# EAGLE design Controller_V5 (EAGLE 5.00)
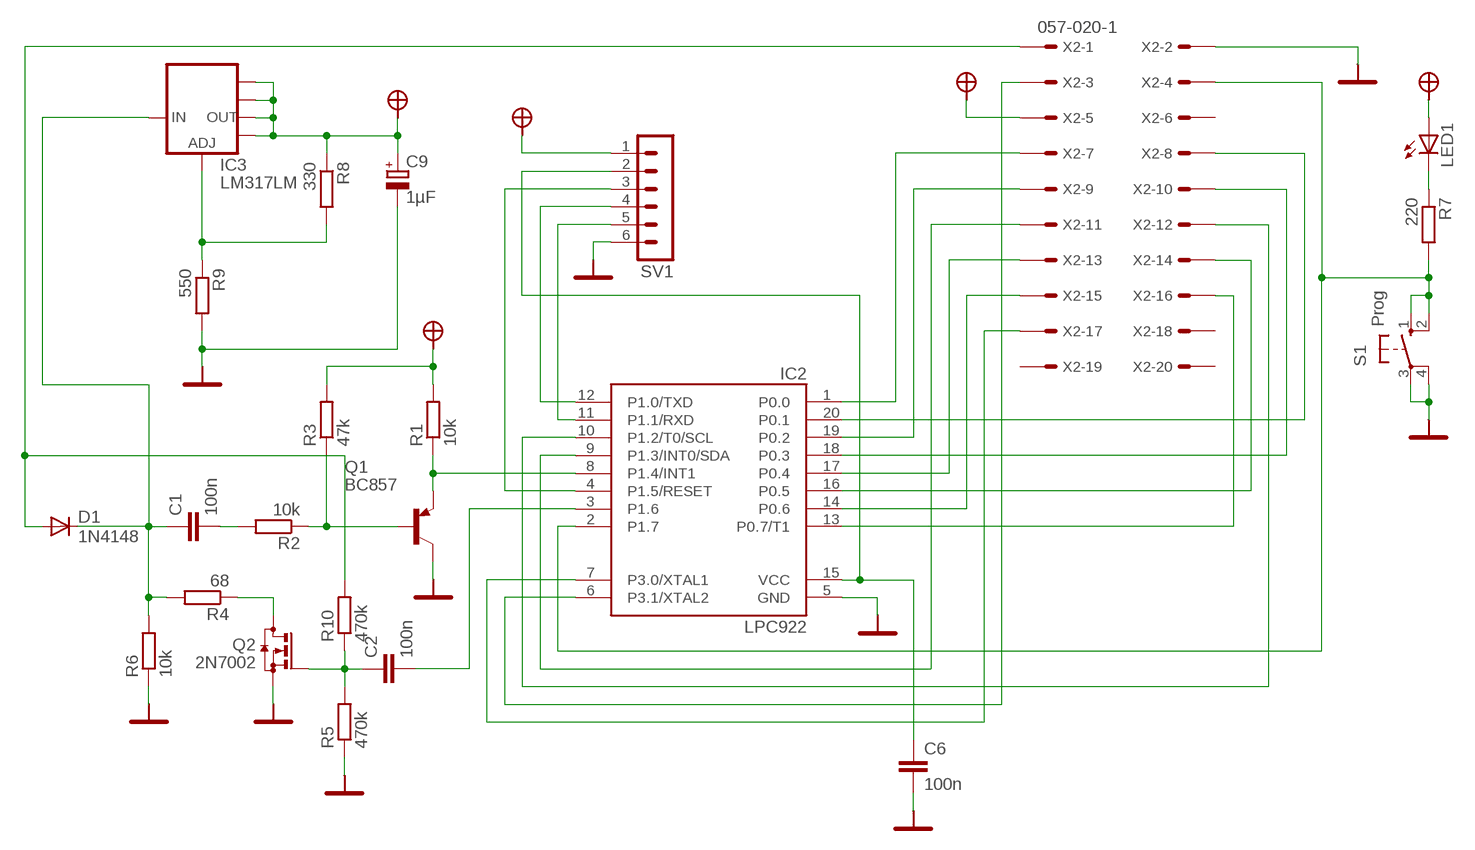
[diagram p0: schematic, sheet 1]

## Parts
C1  100n  C-EUC0805K  [C0805K]
C2  100n  C-EUC0805K  [C0805K]
C6  100n  C-EUC0805K  [C0805K]
C9  1µF  CPOL-EUCT3528  [CT3528]
D1  1N4148  DIODE-SOD106A-R  [SOD106A-R]
IC2  LPC922  [TSSOP20]
IC3  LM317LM  [SO8]
LED1  LEDCHIPLED_1206  [CHIPLED_1206]
Q1  BC857  BC857CSMD  [SOT23-BEC]
Q2  2N7002  BSS123  [SOT23]
R1  10k  R-EU_M0805  [M0805]
R2  10k  R-EU_M0805  [M0805]
R3  47k  R-EU_M0805  [M0805]
R4  68  R-EU_M0805  [M0805]
R5  470k  R-EU_M0805  [M0805]
R6  10k  R-EU_M0805  [M0805]
R7  220  R-EU_M0805  [M0805]
R8  330  R-EU_M0805  [M0805]
R9  550  R-EU_M0805  [M0805]
R10  470k  R-EU_M0805  [M0805]
S1  Prog  10-XX_SMD  [B3F-10XX_SMD]
SV1  MA06-1  [MA06-1]
X2  057-020-1  [057-020-1]

## Nets
5V: C1.1 D1.C IC3.1(IN) R4.2 R6.2
EIB+: D1.A R10.2 X2.1
GND: C6.2 C9.- IC2.5(GND) Q1.C Q2.2(S) R5.1 R6.1 R9.2 S1.3(P) S1.4(P1) SV1.6 X2.2
N$1: IC2.4(P1.5/RESET) SV1.3
N$2: IC2.1(P0.0) X2.7
N$3: C1.2 R2.2
N$4: Q1.B R2.1 R3.1
N$5: LED1.C R7.1
N$6: Q2.3(D) R4.1
N$7: C2.1 Q2.1(G) R5.2 R10.1
N$8: IC2.6(P3.1/XTAL2) X2.3
N$9: IC2.20(P0.1) X2.8
N$10: IC2.11(P1.1/RXD) SV1.5
N$11: IC2.12(P1.0/TXD) SV1.4
N$12: IC2.19(P0.2) X2.9
N$13: IC2.18(P0.3) X2.10
N$14: IC2.17(P0.4) X2.13
N$15: IC2.16(P0.5) X2.14
N$16: IC2.14(P0.6) X2.15
N$17: IC2.13(P0.7/T1) X2.16
N$19: C2.2 IC2.3(P1.6)
N$20: IC2.2(P1.7) R7.2 S1.1(S) S1.2(S1) X2.4
N$21: IC2.10(P1.2/T0/SCL) X2.12
N$22: IC2.9(P1.3/INT0/SDA) X2.11
N$23: IC2.8(P1.4/INT1) Q1.E R1.1
N$25: IC2.7(P3.0/XTAL1) X2.17
N$26: C6.1 IC2.15(VCC) SV1.2
N$27: IC3.4(ADJ) R8.2 R9.1
VCC: C9.+ IC3.2(OUT) IC3.3(OUT) IC3.6(OUT) IC3.7(OUT) LED1.A R1.2 R3.2 R8.1 SV1.1 X2.5
Unconnected: X2.6 X2.18 X2.19 X2.20

## Library data of the parts
C1 C2 C6 = rcl:C-EU: CAPACITOR, European symbol
C9 = rcl:CPOL-EU: POLARIZED CAPACITOR, European symbol
D1 = diode:DIODE-: DIODE
IC2 = Philips:LPC922
IC3 = Reichelt:LM317LM
LED1 = led:LED: LED OSRAM: - CHIPLED LG R971, LG N971, LY N971, LG Q971, LY Q971, LO R971, LY R971 LH N974, LH R974 LS Q976, LO Q976, LY Q976 LO Q996 - Hyper CHIPLED LW Q18S LB Q993, LB Q99A, LB R99A - SideLED LS A670, LO A670, LY A670, LG A670, LP A670 LB A673, LV A673, LT A673, LW A673 LH A674 LY A675 LS A676, LA A676, LO A676, LY A676, LW A676 LS A679, LY A679, LG A679 - Hyper Micro SIDELED® LS Y876, LA Y876, LO Y876, LY Y876 LT Y87S - SmartLED LW L88C, LW L88S LB L89C, LB L89S, LG L890 LS L89K, LO L89K, LY L89K LS L896, LA L896, LO L896, LY L896 - TOPLED LS T670, LO T670, LY T670, LG T670, LP T670 LSG T670, LSP T670, LSY T670, LOP T670, LYG T670 LG T671, LOG T671, LSG T671 LB T673, LV T673, LT T673, LW T673 LH T674 LS T676, LA T676, LO T676, LY T676, LB T676, LH T676, LSB T676, LW T676 LB T67C, LV T67C, LT T67C, LS T67K, LO T67K, LY T67K, LW E67C LS E67B, LA E67B, LO E67B, LY E67B, LB E67C, LV E67C, LT E67C LW T67C LS T679, LY T679, LG T679 LS T770, LO T770, LY T770, LG T770, LP T770 LB T773, LV T773, LT T773, LW T773 LH T774 LS E675, LA E675, LY E675, LS T675 LS T776, LA T776, LO T776, LY T776, LB T776 LHGB T686 LT T68C, LB T68C - Hyper Mini TOPLED® LB M676 - Mini TOPLED Santana® LG M470 LS M47K, LO M47K, LY M47K Source: http://www.osram.convergy.de/
Q1 = transistor-pnp:BC857*: PNP Transistror
Q2 = transistor-small-signal:BSS123: N-CHANNEL MOS FET
R1-R10 = rcl:R-EU_: RESISTOR, European symbol
S1 = switch-omron:10-XX_SMD
SV1 = con-lstb:MA06-1: PIN HEADER
X2 = con-panduit:057-020-: CONNECTOR 20-pin series 057 contact pc board low profile headers

## Board
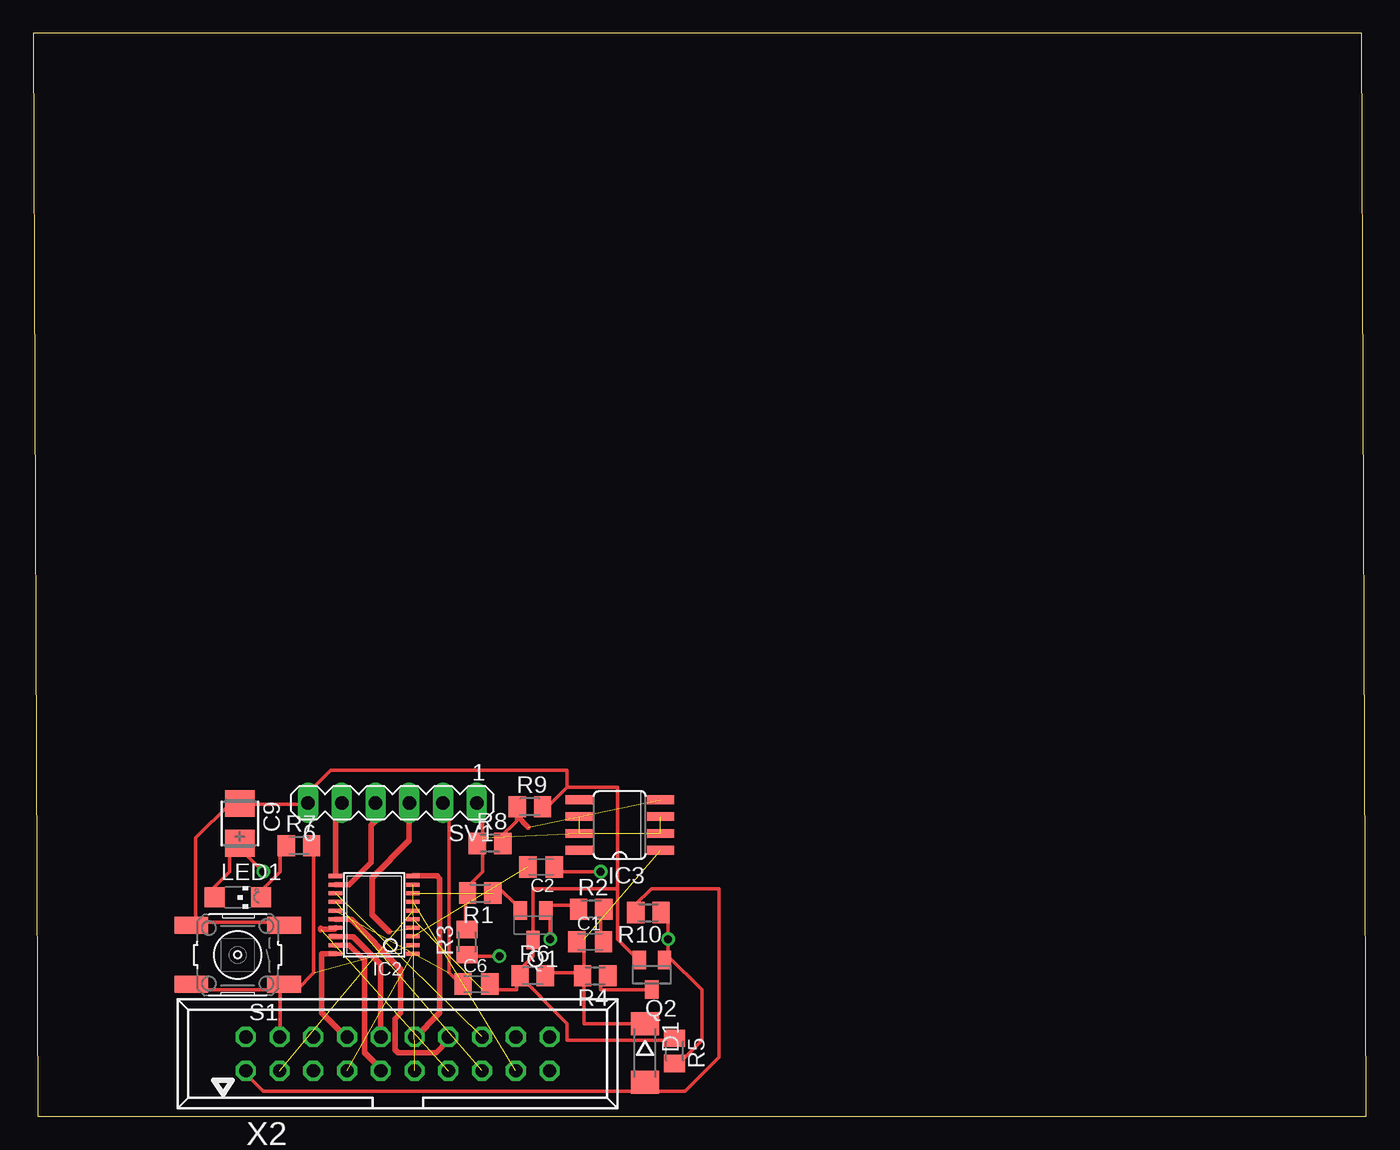
[diagram p1: board, top side]
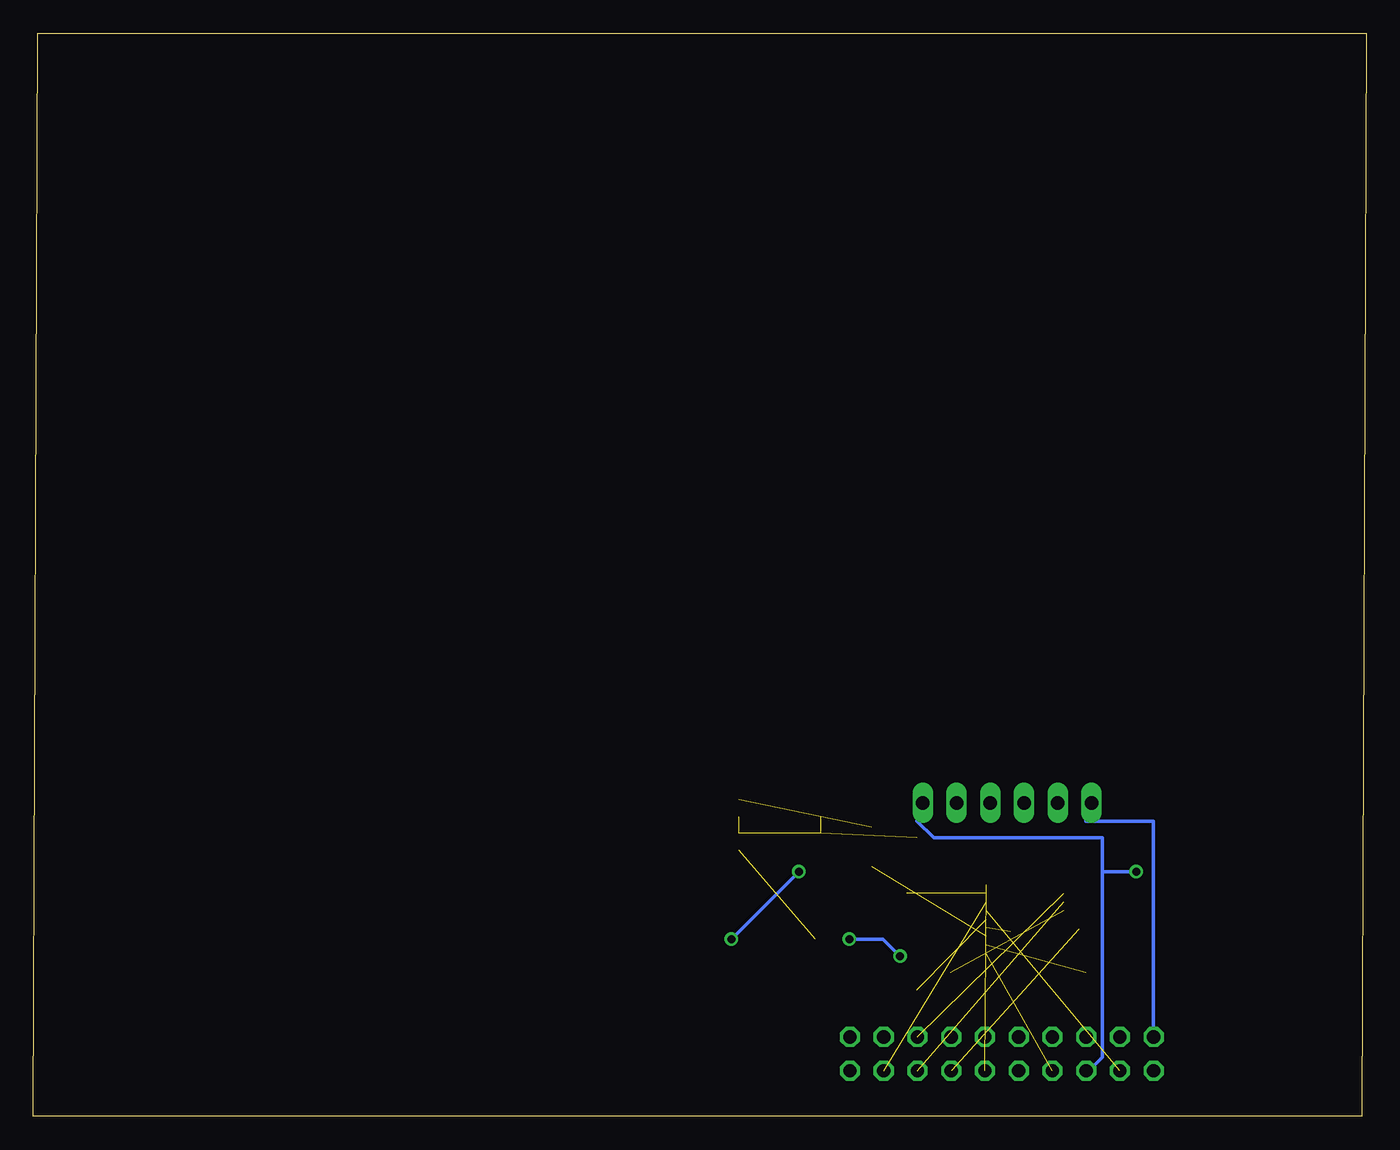
[diagram p2: board, bottom side, seen from below]

Size 100.33 x 81.49 mm. Coordinates in mm from the lower left corner, seen from the top.
Outline: 0.33,0 100.33,0 100,81.49 0,81.49 0.33,0
Copper layers (1*16): Top 0.035mm / dielectric 1.5mm / Bottom 0.035mm
Design rules "default": minimum track width 10mil, minimum drill 24mil, track to track 8mil, track to pad 8mil, pad to pad 8mil, via to via 8mil, smd to smd 8mil, copper to edge 40mil, drill to drill 8mil, minimum pad ring 10mil, minimum via ring 8mil, stop-mask expansion 4mil, vias tented up to drill 0mil, thermal gap 10mil

### Footprints (pad centres in the part's own frame; a part is rotated, then mirrored left to right if it is on the bottom)
C0805K = smd 1.3 x 1.6: 1 -1,0; 2 1,0
CT3528 = smd 2 x 2.2: + 1.5,0; - -1.5,0
SOD106A-R = smd 1.7 x 2.1: A 2.2,0; C -2.2,0
TSSOP20 = smd 0.305 x 0.991: 1 -2.925,-2.918; 2 -2.275,-2.918; 3 -1.625,-2.918; 4 -0.975,-2.918; 5 -0.325,-2.918; 6 0.325,-2.918; 7 0.975,-2.918; 8 1.625,-2.918; 9 2.275,-2.918; 10 2.925,-2.918; 11 2.925,2.918; 12 2.275,2.918; 13 1.625,2.918; 14 0.975,2.918; 15 0.325,2.918; 16 -0.325,2.918; 17 -0.975,2.918; 18 -1.625,2.918; 19 -2.275,2.918; 20 -2.925,2.918
SO8 = smd 0.66 x 2.032: 1 -1.905,-3.073; 2 -0.635,-3.073; 3 0.635,-3.073; 4 1.905,-3.073; 5 1.905,3.073; 6 0.635,3.073; 7 -0.635,3.073; 8 -1.905,3.073
CHIPLED_1206 = smd 1.5 x 1.5: A 0,-1.75; C 0,1.75
SOT23-BEC = smd 1 x 1.4: B -0.95,-1.1; C 0,1.1; E 0.95,-1.1
SOT23 = smd 1 x 1.4: 1 -0.95,-1.1; 2 0.95,-1.1; 3 0,1.1
M0805 = smd 1.3 x 1.6: 1 -0.95,0; 2 0.95,0
B3F-10XX_SMD = smd 2.54 x 1.27: 1 -3.493,2.223; 2 3.493,2.223; 3 -3.493,-2.223; 4 3.493,-2.223
MA06-1 = drill 1.016 long: 1 -6.35,0; 2 -3.81,0; 3 -1.27,0; 4 1.27,0; 5 3.81,0; 6 6.35,0
057-020-1 = drill 1 octagon: 1 -11.43,-1.27; 2 -11.43,1.27; 3 -8.89,-1.27; 4 -8.89,1.27; 5 -6.35,-1.27; 6 -6.35,1.27; 7 -3.81,-1.27; 8 -3.81,1.27; 9 -1.27,-1.27; 10 -1.27,1.27; 11 1.27,-1.27; 12 1.27,1.27; 13 3.81,-1.27; 14 3.81,1.27; 15 6.35,-1.27; 16 6.35,1.27; 17 8.89,-1.27; 18 8.89,1.27; 19 11.43,-1.27; 20 11.43,1.27

### Placement (x,y rotation side)
C1  41.92,13.13 0 top
C2  38.22,18.76 180 top
C6  33.36,9.96 0 top
C9  15.55,22.05 270 top
D1  46.04,4.77 270 top
IC2  25.66,15.16 90 top
IC3  44.14,21.93 90 top
LED1  15.4,16.48 270 top
Q1  37.62,14.38 180 top
Q2  46.56,10.66 180 top
R1  33.64,16.8 180 top
R2  42,15.59 0 top
R3  32.65,13.11 90 top
R4  42.29,10.58 180 top
R5  48.27,4.93 270 top
R6  37.59,10.58 0 top
R7  20.01,20.37 0 top
R8  34.38,20.54 0 top
R9  37.39,23.29 0 top
R10  46.3,15.33 180 top
S1  15.39,12.15 180 top
SV1  27.04,23.59 180 top
X2  27.43,4.71 0 top

### Tracks (layer width: path | path; a pad name or v marks a point on that pad's centre or on a via)
5V  (1 unrouted)
  Top 0.254: 41.44,10.79 38.9,10.79 R6.2 | 41.44,10.79 41.44,13.33 C1.1 | 41.44,10.79 41.44,6.98 45.25,6.98 D1.C | 41.44,10.79 R4.2
EIB+
  Top 0.254: R10.2 45.25,15.87 46.52,17.14 51.6,17.14 51.6,4.44 49.06,1.9 46.52,1.9 D1.A 45.25,1.9 17.31,1.9 16.04,3.17 X2.1
GND  (1 unrouted)
  Top 0.254: 12.23,14.6 18.58,14.6 S1.3 | 12.23,14.6 12.23,20.95 14.77,23.49 C9.- 16.04,23.49 21.12,23.49 SV1.6 21.12,24.76 22.39,26.03 40.17,26.03 40.17,24.76 | 12.23,14.6 S1.4 | 36.36,10.79 36.36,9.52 33.82,9.52 C6.2 | 36.36,10.79 40.17,6.98 40.17,5.71 47.79,5.71 R5.1 | 43.98,17.14 43.98,13.33 45.25,12.06 Q2.2 | 43.98,17.14 37.63,17.14 37.63,13.33 | 40.17,24.76 38.9,23.49 R9.2 | 40.17,24.76 43.98,24.76 43.98,17.14 | 36.36,10.79 37.63,12.06 37.63,13.33 | 36.36,10.79 R6.1 | 37.63,13.33 Q1.C
  Bottom 0.254: X2.2 16.04,5.71 16.04,22.22 21.12,22.22 SV1.6
N$1  (1 unrouted)
  Top 0.406: SV1.3 28.31,20.76 25.51,17.96 25.51,15.17 26.8,13.88
N$2  (1 unrouted)
N$3
  Top 0.254: C1.2 42.71,13.33 42.71,15.87 R2.2
N$4  (via drill 0.61)
  Top 0.254: 38.9,15.87 41.44,15.87 R2.1 | v35.09,12.06 32.55,12.06 R3.1 | v38.9,13.33 38.9,15.87 | 38.9,15.87 Q1.B
  Bottom 0.254: v35.09,12.06 36.36,13.33 v38.9,13.33
N$5
  Top 0.254: LED1.C 17.31,17.14 18.58,18.41 18.58,19.68 R7.1
N$6
  Top 0.254: Q2.3 46.52,9.52 42.71,9.52 42.71,10.79 R4.1
N$7  (via drill 0.61)
  Top 0.254: 47.79,12.06 v47.79,13.33 47.79,14.6 R10.1 | v42.71,18.41 38.9,18.41 C2.1 | 47.79,12.06 50.33,9.52 50.33,5.71 49.06,4.44 R5.2 | 47.79,12.06 Q2.1
  Bottom 0.254: v47.79,13.33 v42.71,18.41
N$8  (1 unrouted)
N$9
  Top 0.406: IC2.20 21.72,12.24 21.72,12.23 21.72,7.79 23.62,5.89 | 23.8,5.72 23.62,5.89 | 23.62,5.89 X2.8
N$10
  Top 0.406: IC2.11 22.74,22.36 23.29,22.91 23.29,23.41 23.23,23.47 SV1.5
N$11
  Top 0.406: IC2.12 23.77,17.44 25.44,19.11 25.44,21.9 25.8,22.26 25.8,22.83 25.94,22.98 25.94,23.34 25.77,23.51 SV1.4
N$12
  Top 0.406: IC2.19 23.79,12.89 24.94,11.73 24.94,4.78 26.29,3.44 | 26.45,3.28 26.29,3.44 | 26.29,3.44 X2.9
N$13
  Top 0.406: X2.10 26.16,11.44 24.08,13.52 22.43,13.52 22.45,13.54 IC2.18
N$14  (1 unrouted)
  Top 0.406: IC2.17 22.65,14.1 21.72,14.1 21.65,14.17 21.65,14.1 21.65,14.03
N$15
  Top 0.406: IC2.16 23.91,14.84 27.66,11.09 27.66,7.79 27.23,7.36 27.23,5 27.45,4.78 30.31,4.78 31.24,5.71 X2.14
N$16  (1 unrouted)
N$17  (1 unrouted)
N$19  (1 unrouted)
N$20  (1 unrouted)
  Top 0.254: R7.2 21.12,19.68 21.12,10.79 19.85,9.52 S1.1 18.58,9.52 | 18.58,9.52 12.23,9.52 S1.2 | 18.58,9.52 18.58,5.71 X2.4
N$21
  Top 0.406: IC2.10 30.41,18.09 30.6,17.89 30.6,7.79 28.7,5.89 | 28.67,5.86 28.7,5.89 | 28.7,5.89 X2.12
N$22  (1 unrouted)
N$23  (1 unrouted)
  Top 0.254: Q1.E 36.36,15.87 35.09,17.14 R1.1
N$25  (1 unrouted)
N$26  (1 unrouted)
  Top 0.254: C6.1 32.55,9.52 31.28,10.79 31.28,22.22 SV1.2
N$27  (1 unrouted)
  Top 0.254: R8.2 35.09,20.95 36.36,22.22 36.36,23.49 R9.1
  Top 0.406: R9.1 36.44,22.59 37.26,21.76
VCC  (via drill 0.61)  (4 unrouted)
  Top 0.254: LED1.A 13.5,17.14 14.77,18.41 14.77,19.68 C9.+ 16.04,19.68 v17.31,18.41 | 32.55,17.14 32.55,14.6 R3.2 | 33.82,20.95 33.82,22.22 SV1.1 | 32.55,17.14 33.82,18.41 33.82,20.95 | 32.55,17.14 R1.2 | 33.82,20.95 R8.1
  Bottom 0.254: 19.85,18.41 19.85,20.95 32.55,20.95 33.82,22.22 SV1.1 | 19.85,18.41 19.85,4.44 21.12,3.17 X2.5 | 19.85,18.41 v17.31,18.41